# EAGLE schematic Main-Board (EAGLE 6.4)
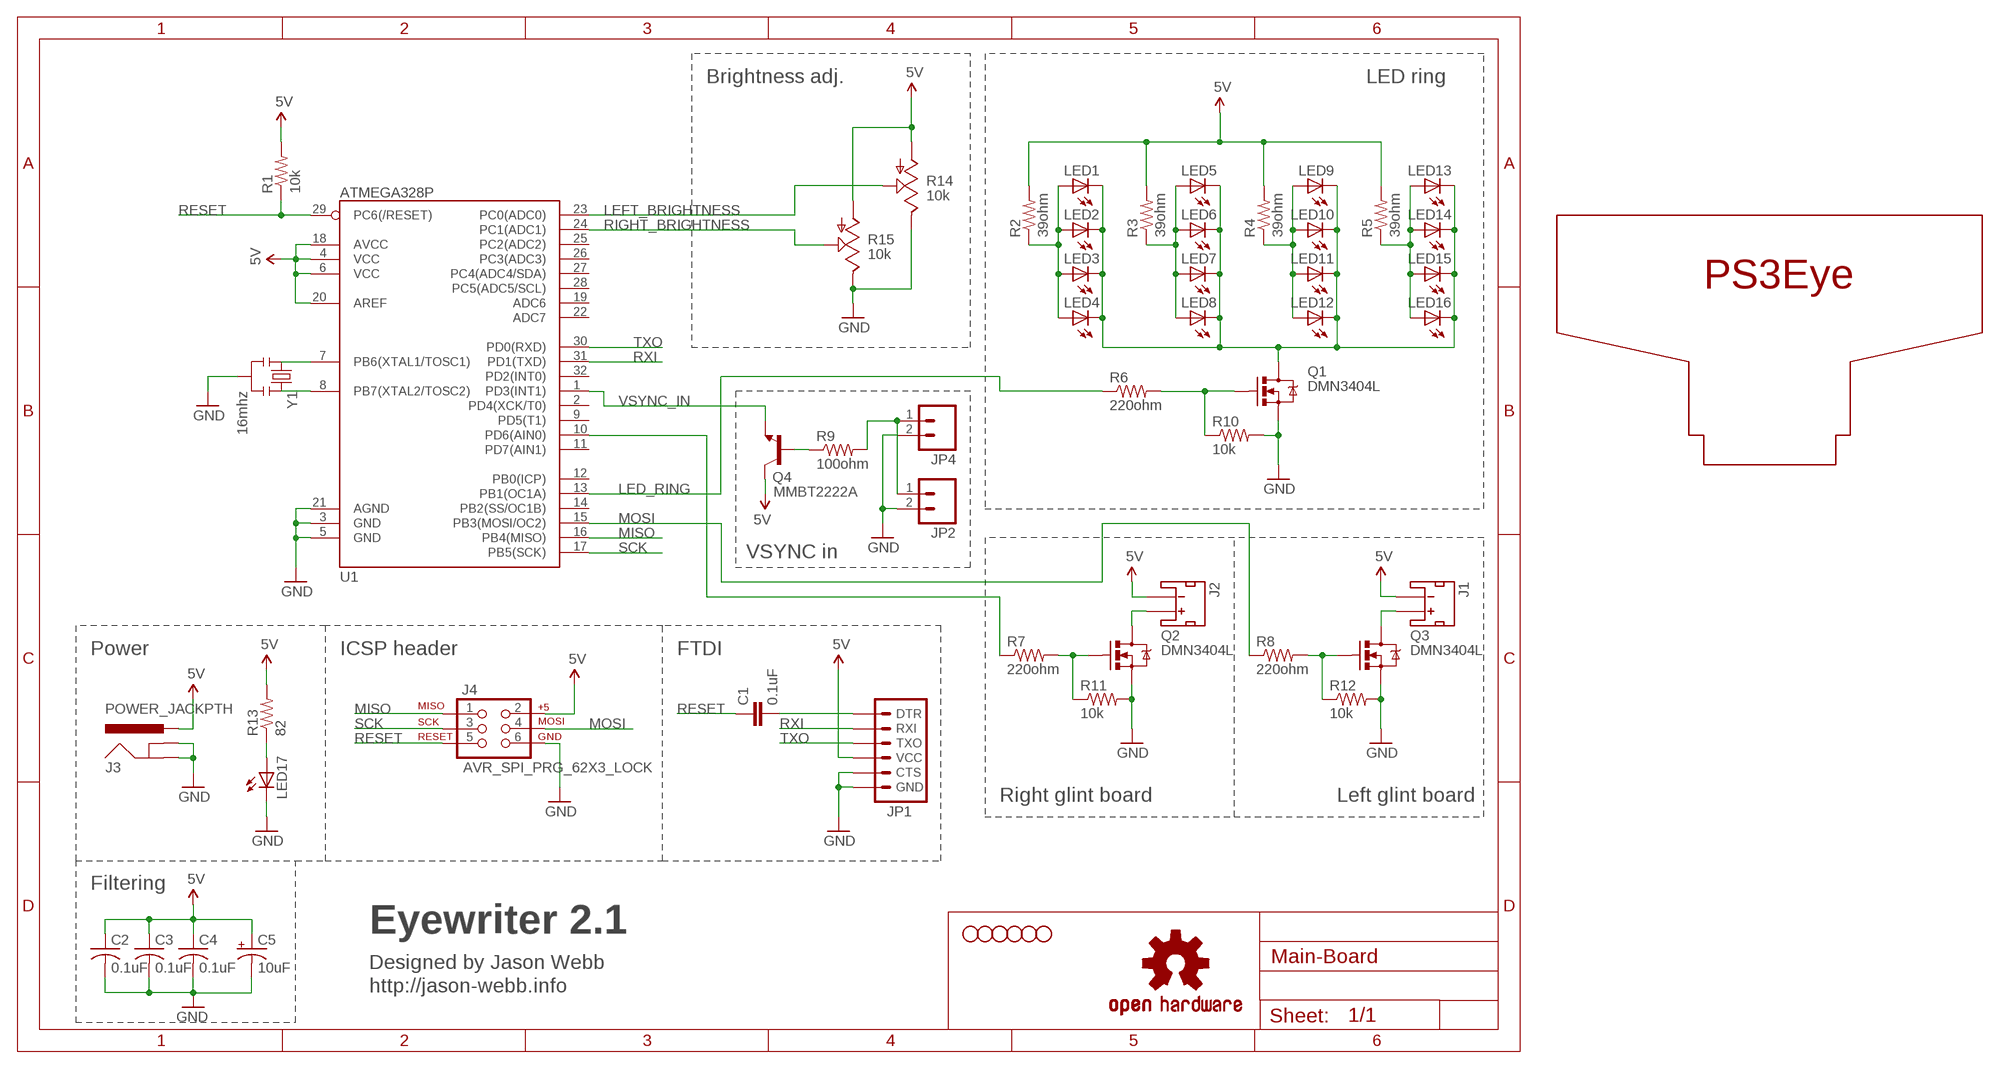
[diagram p0: schematic, sheet 1]

## Parts
C1  0.1uF  CAP0805  [0805]
C2  0.1uF  C-USC0805K  [C0805K]
C3  0.1uF  C-USC0805K  [C0805K]
C4  0.1uF  C-USC0805K  [C0805K]
C5  10uF  CPOL-USA/3216-18R  [A/3216-18R]
J1  JST_2MM_MALE  [JST-2-SMD]
J2  JST_2MM_MALE  [JST-2-SMD]
J3  POWER_JACKPTH  [POWER_JACK_PTH]
J4  AVR_SPI_PRG_62X3_LOCK  [2X3_LOCK]
JP1  ARDUINO_SERIAL_PROGRAMLOCK  [1X06_LOCK]
JP2  M02PTH  [1X02]
JP4  M02PTH  [1X02]
LED1  LED5MM  [LED5MM]
LED2  LED5MM  [LED5MM]
LED3  LED5MM  [LED5MM]
LED4  LED5MM  [LED5MM]
LED5  LED5MM  [LED5MM]
LED6  LED5MM  [LED5MM]
LED7  LED5MM  [LED5MM]
LED8  LED5MM  [LED5MM]
LED9  LED5MM  [LED5MM]
LED10  LED5MM  [LED5MM]
LED11  LED5MM  [LED5MM]
LED12  LED5MM  [LED5MM]
LED13  LED5MM  [LED5MM]
LED14  LED5MM  [LED5MM]
LED15  LED5MM  [LED5MM]
LED16  LED5MM  [LED5MM]
LED17  LEDCHIPLED_0805  [CHIPLED_0805]
LOGO1  OSHW-LOGOL  [OSHW-LOGO-L]
Q1  DMN3404L  MOSFET-NCHANNELSMD  [SOT23-3]
Q2  DMN3404L  MOSFET-NCHANNELSMD  [SOT23-3]
Q3  DMN3404L  MOSFET-NCHANNELSMD  [SOT23-3]
Q4  MMBT2222A  TRANSISTOR_NPNSOT23  [SOT23]
R1  10k  RESISTOR0805-RES  [0805]
R2  39ohm  R-US_0309/10  [0309/10]
R3  39ohm  R-US_0309/10  [0309/10]
R4  39ohm  R-US_0309/10  [0309/10]
R5  39ohm  R-US_0309/10  [0309/10]
R6  220ohm  RESISTOR0805-RES  [0805]
R7  220ohm  RESISTOR0805-RES  [0805]
R8  220ohm  RESISTOR0805-RES  [0805]
R9  100ohm  RESISTOR0805-RES  [0805]
R10  10k  RESISTOR0805-RES  [0805]
R11  10k  RESISTOR0805-RES  [0805]
R12  10k  RESISTOR0805-RES  [0805]
R13  82  RESISTOR0805-RES  [0805]
R14  10k  POT  [ALPS_POT]
R15  10k  POT  [ALPS_POT]
STANDOFF1  STAND-OFF  [STAND-OFF]
STANDOFF2  STAND-OFF  [STAND-OFF]
STANDOFF3  STAND-OFF  [STAND-OFF]
STANDOFF4  STAND-OFF  [STAND-OFF]
STANDOFF5  STAND-OFF  [STAND-OFF]
STANDOFF6  STAND-OFF  [STAND-OFF]
U1  ATMEGA328P  ATMEGA328_SMT  [TQFP32-08]
U$1  PS3EYE  [PS3EYE]
Y1  16mhz  RESONATOR16MHZ  [RESONATOR-SMD]

## Nets
5V: C2.1 C3.1 C4.1 C5.+ J1.1(-) J2.1(-) J3.PWR J4.2 JP1.4(VCC) Q4.3(C) R1.2 R2.2 R3.2 R4.2 R5.2 R13.2 R14.P$3(A) R15.P$3(A) U1.4(VCC) U1.6(VCC) U1.18(AVCC) U1.20(AREF)
GLINT_RIGHT: R8.1 U1.15(PB3(MOSI/OC2))
GND: C2.2 C3.2 C4.2 C5.- J3.GND J3.GNDBREAK J4.6 JP1.5(CTS) JP1.6(GND) JP2.2 JP4.2 LED17.C Q1.2(S) Q2.2(S) Q3.2(S) R10.2 R11.2 R12.2 R14.P$1(E) R15.P$1(E) U1.3(GND) U1.5(GND) U1.21(AGND) Y1.2
LED_RING: R6.1 U1.13(PB1(OC1A))
LEFT_BRIGHTNESS: R14.P$2(S) U1.23(PC0(ADC0))
MISO: J4.1 U1.16(PB4(MISO))
MOSI: J4.4 R7.1 U1.10(PD6(AIN0))
N$1: LED17.A R13.1
N$2: U1.7(PB6(XTAL1/TOSC1)) Y1.1
N$3: U1.8(PB7(XTAL2/TOSC2)) Y1.3
N$4: LED1.A LED2.A LED3.A LED4.A R2.1
N$5: J2.2(+) Q2.3(D)
N$6: LED5.A LED6.A LED7.A LED8.A R3.1
N$7: Q1.1(G) R6.2 R10.1
N$8: LED9.A LED10.A LED11.A LED12.A R4.1
N$9: Q2.1(G) R7.2 R11.1
N$10: LED13.A LED14.A LED15.A LED16.A R5.1
N$11: J1.2(+) Q3.3(D)
N$12: JP2.1 JP4.1 R9.2
N$13: LED1.K(C) LED2.K(C) LED3.K(C) LED4.K(C) LED5.K(C) LED6.K(C) LED7.K(C) LED8.K(C) LED9.K(C) LED10.K(C) LED11.K(C) LED12.K(C) LED13.K(C) LED14.K(C) LED15.K(C) LED16.K(C) Q1.3(D)
N$14: Q3.1(G) R8.2 R12.1
N$15: Q4.1(B) R9.1
N$16: C1.2 JP1.1(DTR)
RESET: C1.1 J4.5 R1.1 U1.29(PC6(/RESET))
RIGHT_BRIGHTNESS: R15.P$2(S) U1.24(PC1(ADC1))
RXI: JP1.2(RXI) U1.31(PD1(TXD))
SCK: J4.3 U1.17(PB5(SCK))
TXO: JP1.3(TXO) U1.30(PD0(RXD))
VSYNC_IN: Q4.2(E) U1.1(PD3(INT1))
Unconnected: J1.NC1(PAD1) J1.NC2(PAD2) J2.NC1(PAD1) J2.NC2(PAD2) U1.2(PD4(XCK/T0)) U1.9(PD5(T1)) U1.11(PD7(AIN1)) U1.12(PB0(ICP)) U1.14(PB2(SS/OC1B)) U1.19(ADC6) U1.22(ADC7) U1.25(PC2(ADC2)) U1.26(PC3(ADC3)) U1.27(PC4(ADC4/SDA)) U1.28(PC5(ADC5/SCL)) U1.32(PD2(INT0))

## Notes on the sheet
- Brightness adj. | LED ring
- VSYNC in
- Power | ICSP header | FTDI
- Right glint board | Left glint board
- Filtering
- Eyewriter 2.1
- Designed by Jason Webb
- http://jason-webb.info

## Library data of the parts
C1 = SparkFun-Capacitors:CAP: Capacitor Standard 0603 ceramic capacitor, and 0.1" leaded capacitor.
C2-C4 = adafruit:C-US: CAPACITOR, American symbol
C5 = adafruit:CPOL-US: POLARIZED CAPACITOR, American symbol
J1 J2 = SparkFun-Connectors:JST_2MM_MALE: Mates to single-cell LiPo batteries. CONN-08352; PROD_ID: CONN-08352
J3 = SparkFun-Connectors:POWER_JACK: Power Jack This is the standard 5.5mm barrel jack for power. The PTH is the most common, proven, reliable, footprint. The Slot footprint only works if the mill layer is transmitted to the PCB fab house so be warned. Spark Fun Electronics SKU : PRT-00119 SMT: CONN-08106 Mating wall wart : TOL-00298 (and others)
J4 = SparkFun-Connectors:AVR_SPI_PRG_6: AVR ISP 6 Pin This is the reduced ISP connector for AVR programming. Common on Arduino. This footprint will take up less PCB space and can be used with a 10-pin to 6-pin adapter such as SKU: BOB-08508
JP1 = SparkFun-Connectors:ARDUINO_SERIAL_PROGRAM: FTDI connector footprints
JP2 JP4 = SparkFun-Connectors:M02: Header 2 Standard 2-pin 0.1" header. Use with straight break away headers (SKU : PRT-00116), right angle break away headers (PRT-00553), swiss pins (PRT-00743), machine pins (PRT-00117), and female headers (PRT-00115). Molex polarized connector foot print use with SKU : PRT-08233 with associated crimp pins and housings.
LED1-LED16 = SparkFun-LED:LED: LEDs Standard schematic elements and footprints for 5mm, 3mm, 1206, and 0603 sized LEDs. 5mm - Spark Fun Electronics SKU : COM-00529 (and others)
LED17 = led:LED: LED OSRAM: - CHIPLED LG R971, LG N971, LY N971, LG Q971, LY Q971, LO R971, LY R971 LH N974, LH R974 LS Q976, LO Q976, LY Q976 LO Q996 - Hyper CHIPLED LW Q18S LB Q993, LB Q99A, LB R99A - SideLED LS A670, LO A670, LY A670, LG A670, LP A670 LB A673, LV A673, LT A673, LW A673 LH A674 LY A675 LS A676, LA A676, LO A676, LY A676, LW A676 LS A679, LY A679, LG A679 - Hyper Micro SIDELED® LS Y876, LA Y876, LO Y876, LY Y876 LT Y87S - SmartLED LW L88C, LW L88S LB L89C, LB L89S, LG L890 LS L89K, LO L89K, LY L89K LS L896, LA L896, LO L896, LY L896 - TOPLED LS T670, LO T670, LY T670, LG T670, LP T670 LSG T670, LSP T670, LSY T670, LOP T670, LYG T670 LG T671, LOG T671, LSG T671 LB T673, LV T673, LT T673, LW T673 LH T674 LS T676, LA T676, LO T676, LY T676, LB T676, LH T676, LSB T676, LW T676 LB T67C, LV T67C, LT T67C, LS T67K, LO T67K, LY T67K, LW E67C LS E67B, LA E67B, LO E67B, LY E67B, LB E67C, LV E67C, LT E67C LW T67C LS T679, LY T679, LG T679 LS T770, LO T770, LY T770, LG T770, LP T770 LB T773, LV T773, LT T773, LW T773 LH T774 LS E675, LA E675, LY E675, LS T675 LS T776, LA T776, LO T776, LY T776, LB T776 LHGB T686 LT T68C, LB T68C - Hyper Mini TOPLED® LB M676 - Mini TOPLED Santana® LG M470 LS M47K, LO M47K, LY M47K Source: http://www.osram.convergy.de LUXEON: - LUMILED® LXK2-PW12-R00, LXK2-PW12-S00, LXK2-PW14-U00, LXK2-PW14-V00 LXK2-PM12-R00, LXK2-PM12-S00, LXK2-PM14-U00 LXK2-PE12-Q00, LXK2-PE12-R00, LXK2-PE12-S00, LXK2-PE14-T00, LXK2-PE14-U00 LXK2-PB12-K00, LXK2-PB12-L00, LXK2-PB12-M00, LXK2-PB14-N00, LXK2-PB14-P00, LXK2-PB14-Q00 LXK2-PR12-L00, LXK2-PR12-M00, LXK2-PR14-Q00, LXK2-PR14-R00 LXK2-PD12-Q00, LXK2-PD12-R00, LXK2-PD12-S00 LXK2-PH12-R00, LXK2-PH12-S00 LXK2-PL12-P00, LXK2-PL12-Q00, LXK2-PL12-R00 Source: www.luxeon.com KINGBRIGHT: KA-3528ASYC Source: www.kingbright.com
LOGO1 = SparkFun-Aesthetics:OSHW-LOGO: Open Source Hardware Logo This logo indicates the piece of hardware it is found on incorporates a OSHW license and/or adheres to the definition of open source hardware found here: http://freedomdefined.org/OSHW
Q1-Q3 = SparkFun-DiscreteSemi:MOSFET-NCHANNEL: Generic NMOS footprint
Q4 = SparkFun-DiscreteSemi:TRANSISTOR_NPN: Generic NPN BJT. MMBT2222 is the common NPN we use. Double check against datasheet- not all devices are the same!
R1 R6-R13 = SparkFun-Resistors:RESISTOR: Resistor Basic schematic elements and footprints for 0603, 1206, and PTH resistors.
R2-R5 = resistor:R-US_: RESISTOR, American symbol
R14 R15 = SparkFun-Electromechanical:POT
STANDOFF1-STANDOFF6 = SparkFun-Electromechanical:STAND-OFF: #4 Stand Off This is the mechanical footprint for a #4 phillips button head screw. Use the keepout ring to avoid running the screw head into surrounding components. SKU : PRT-00447
U1 = SparkFun-DigitalIC:ATMEGA328_SMT: 32-Pin Atmega328 part Commonly used on Arduino compatible boards Available in QFP and QFN packages TQFP is IC-09069 QFN is non-stock; PROD_ID: IC-09069
U$1 = ps3eye:PS3EYE
Y1 = SparkFun-FreqCtrl:RESONATOR: Resonator Small SMD resonator. Used, eg, on the Arduino Pro/ Pro Mini boards. 8MHz- XTAL-08895 16MHz- XTAL-08900; PROD_ID: XTAL-08900; VALUE: 16MHz